# EAGLE board MJ838 - rev.1 - TCAN334 - poc (EAGLE 9.6.2)
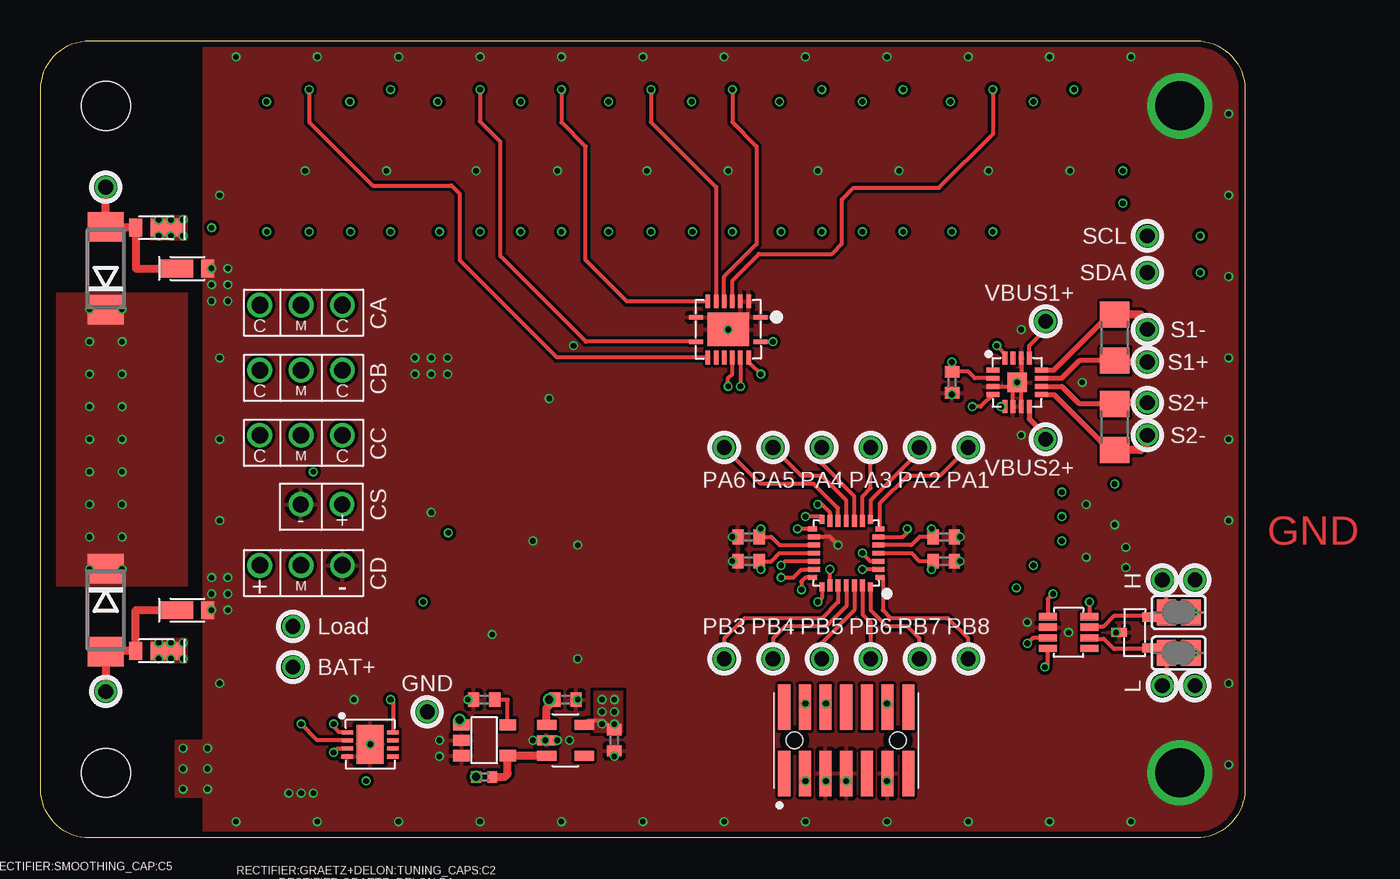
[diagram p18: board, top side]
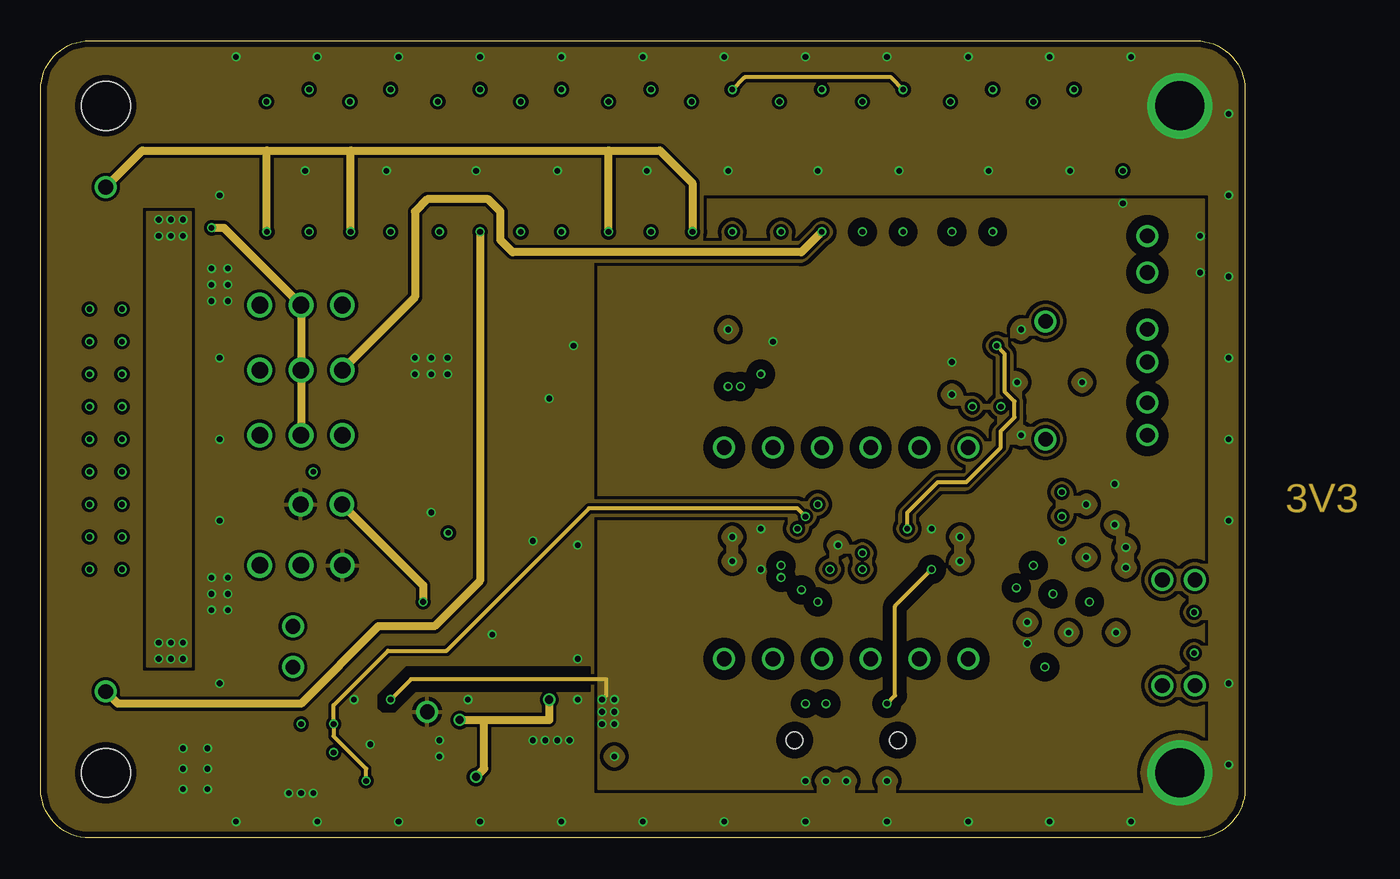
[diagram p19: board, inner layer Route2]
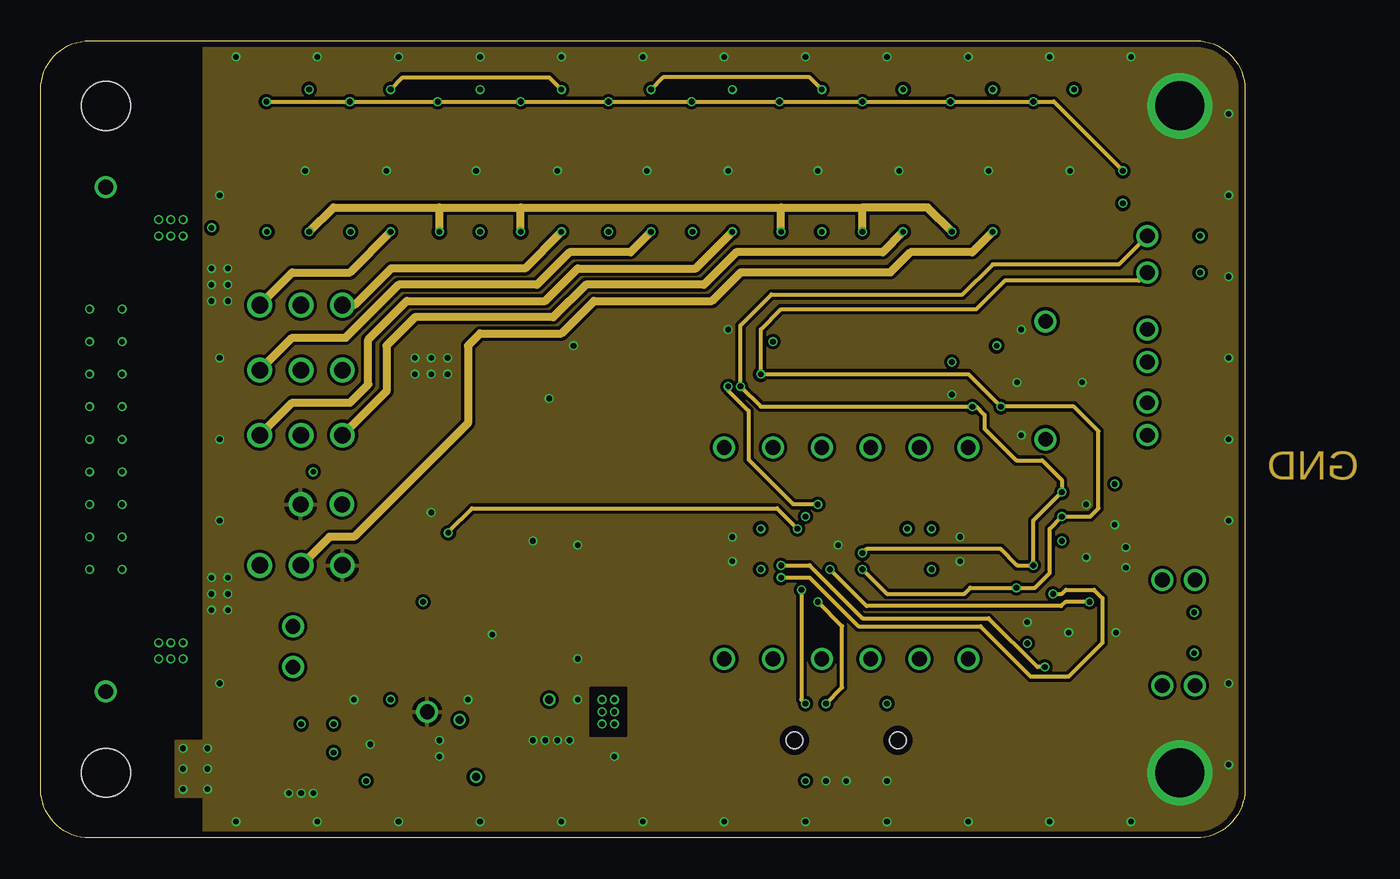
[diagram p20: board, inner layer Route15]
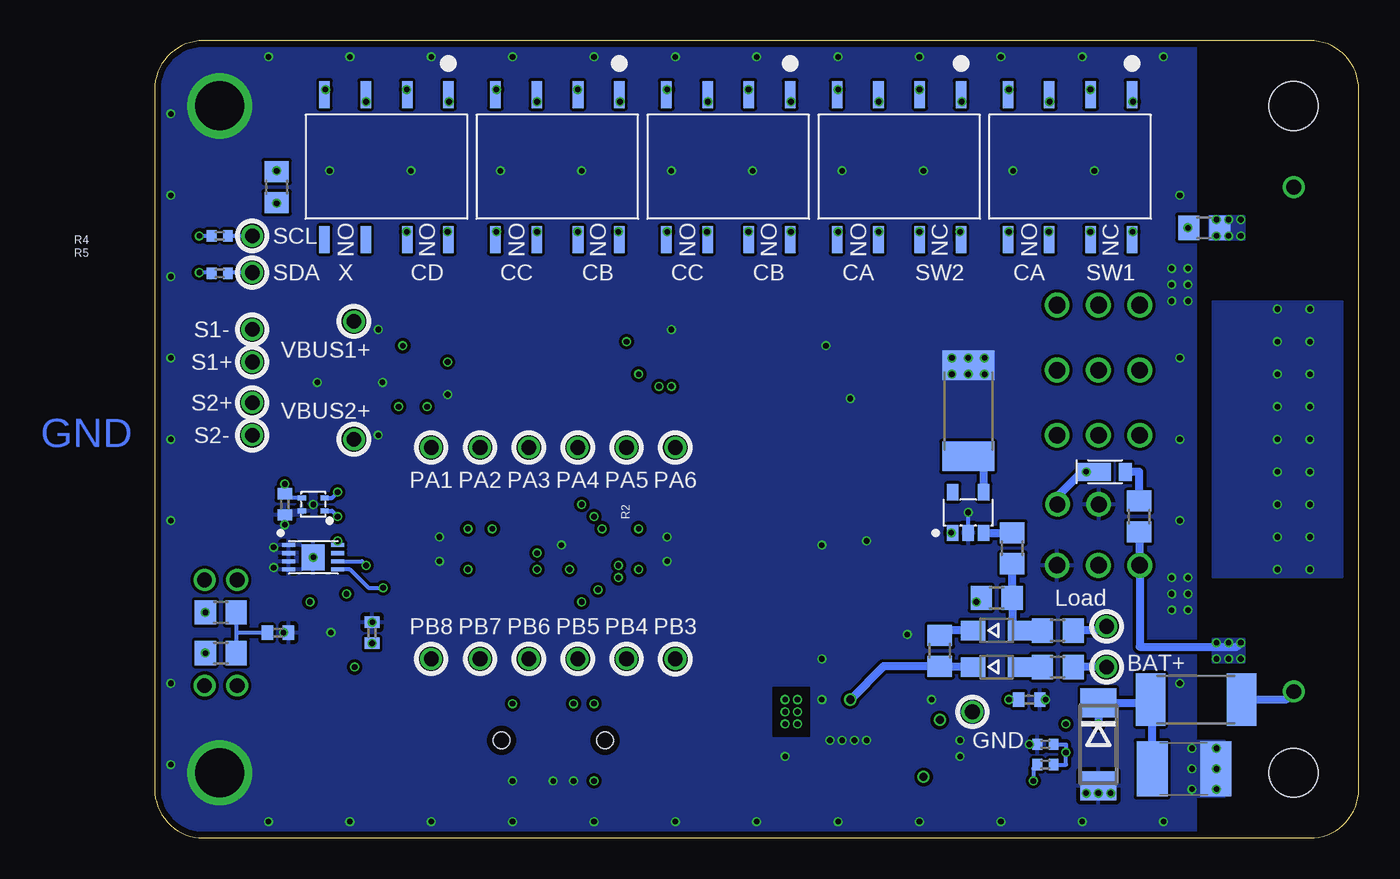
[diagram p21: board, bottom side, seen from below]

Size 74 x 49 mm. Coordinates in mm from the lower left corner, seen from the top.
Outline: 74,46 74,3 arc-90 71,0 3,0 arc-90 0,3 0,46 arc-90 3,49 71,49 arc-90 74,46
Copper layers (1*2*15*16): Top 0.035559375mm / dielectric 0.17018125mm / Route2 0.01778125mm / dielectric 47mil / Route15 0.01778125mm / dielectric 0.17018125mm / Bottom 0.035559375mm
Design rules "oshpark-4layer": minimum track width 5mil, minimum drill 10mil, track to track 5mil, track to pad 5mil, pad to pad 5mil, via to via 5mil, smd to smd 5mil, copper to edge 15mil, drill to drill 6mil, minimum pad ring 4mil, minimum via ring 4mil, stop-mask expansion 1.5mil, vias tented up to drill 0mil, thermal gap 10mil
Net classes: 0 GND: width 0.25 mm, drill 0.35 mm, clearance 0.19 mm; 1 BAT+: width 0.5 mm, drill 0.5 mm, clearance 0.5 mm to class 0, clearance 0.5 mm; 2 signal: width 0.25 mm, drill 0.35 mm, clearance 0.19 mm to class 0, clearance 0.19 mm to class 1, clearance 0.19 mm; 3 3V3: width 0.25 mm, drill 0.35 mm, clearance 0.19 mm to class 0, clearance 0.19 mm to class 1, clearance 0.19 mm to class 2, clearance 0.19 mm; 4 VDC: width 0.5 mm, drill 0.35 mm, clearance 0.5 mm to class 0, clearance 0.5 mm to class 1, clearance 0.5 mm to class 2, clearance 0.5 mm to class 3, clearance 0.5 mm; 5 VDynamo: width 0.5 mm, drill 0.35 mm, clearance 0.5 mm to class 0, clearance 0.5 mm to class 1, clearance 0.5 mm to class 2, clearance 0.5 mm to class 3, clearance 0.5 mm to class 4, clearance 0.5 mm; 6 VAC: width 0.5 mm, drill 0.35 mm, clearance 0.5 mm to class 0, clearance 0.5 mm to class 1, clearance 0.5 mm to class 2, clearance 0.5 mm to class 3, clearance 0.5 mm to class 4, clearance 0.5 mm to class 5, clearance 0.5 mm
Holes 3 mm at 4,45 4,4
tKeepout: area 66.5,41.5 to 73.5,48.5; area 0.5,0.5 to 7.5,7.5; area 0.5,41.5 to 7.5,48.5; area 66.5,0.5 to 73.5,7.5
bKeepout: area 0.5,0.5 to 7.5,7.5; area 0.5,41.5 to 7.5,48.5; area 66.5,0.5 to 73.5,7.5; area 66.5,41.5 to 73.5,48.5
tRestrict: 6 lines
bRestrict: 2 lines

## Footprints (pad centres in the part's own frame; a part is rotated, then mirrored left to right if it is on the bottom)
C0402 = smd 0.7 x 0.9: 1 -0.65,0; 2 0.65,0
SOD323-W = smd 1.5 x 1.2: A 1.45,0; C -1.45,0
UFQFPN-28 = smd 0.55 x 0.3: 1_PB8 -2.08,1.5; 7_PA1 -2.08,-1.5; 15_PB1 2.08,-1.5; 21_PA13 2.08,1.5 | smd 0.75 x 0.3: 2_PF0 -1.98,1; 3_PF1 -1.98,0.5; 4_NRST -1.98,0; 5_VDDA -1.98,-0.5; 6_PA0 -1.98,-1; 16_VSS 1.98,-1; 17_VDD 1.98,-0.5; 18_VDDIO2 1.98,0; 19_PA9-[PA11] 1.98,0.5; 20_PA10-[PA12] 1.98,1 | smd 0.3 x 0.55: 8_PA2 -1.5,-2.08; 14_PB0 1.5,-2.08; 22_PA14 1.5,2.08; 28_PB7 -1.5,2.08 | smd 0.3 x 0.75: 9_PA3 -1,-1.98; 10_PA4 -0.5,-1.98; 11_PA5 0,-1.98; 12_PA6 0.5,-1.98; 13_PA7 1,-1.98; 23_PA15 1,1.98; 24_PB3 0.5,1.98; 25_PB4 0,1.98; 26_PB5 -0.5,1.98; 27_PB6 -1,1.98
SOT23-8 = smd 0.45 x 1.1: P$1 -0.975,-1.275; P$2 -0.325,-1.275; P$3 0.325,-1.275; P$4 0.975,-1.275; P$5 0.975,1.275; P$6 0.325,1.275; P$7 -0.325,1.275; P$8 -0.975,1.275
SOT-23-3 = smd 0.56 x 0.95: 1 -0.95,-0.95; 2 0.95,-0.95; 3 0,0.95
VQFN16 = smd 0.8 x 0.3: 1_SLOW/!ALERT1! -1.5,0.75; 2_VDD -1.5,0.25; 3_GND -1.5,-0.25; 4_SCL -1.5,-0.75; 9_SENSE2- 1.5,-0.75; 10_SENSE2+ 1.5,-0.25; 11_SENSE1+ 1.5,0.25; 12_SENSE1- 1.5,0.75 | smd 0.3 x 0.8: 5_SDA -0.75,-1.5; 6_ADDRSEL -0.25,-1.5; 7_VBUS2- 0.25,-1.5; 8_VBUS2+ 0.75,-1.5; 13_VBUS1+ 0.75,1.5; 14_VBUS1- 0.25,1.5; 15_GPIO/!ALERT2! -0.25,1.5; 16_!PWRDN! -0.75,1.5 | smd 1.2 x 1.2: 17_GND 0,0
SON-8 = smd 0.25 x 0.8: P$1 -0.75,-1.5; P$2 -0.25,-1.5; P$3 0.25,-1.5; P$4 0.75,-1.5; P$5 0.75,1.5; P$6 0.25,1.5; P$7 -0.25,1.5; P$8 -0.75,1.5 | smd 1.6 x 1.4: P$9 0,0
SOT-23-5 = smd 0.7 x 1: P$1 0.95,1.25; P$2 0,1.25; P$3 -0.95,1.25; P$4 -0.95,-1.25; P$5 0.95,-1.25
SMD = smd 0.5 x 0.3: SCL -0.7,-0.4; SDA -0.7,0.4; VDD 0.7,-0.4; VSS 0.7,0.4
FTSH10701LDVKA = smd 0.74 x 2.79: 1 -3.81,-2.035; 2 -3.81,2.035; 3 -2.54,-2.035; 4 -2.54,2.035; 5 -1.27,-2.035; 6 -1.27,2.035; 7 0,-2.035; 8 0,2.035; 9 1.27,-2.035; 10 1.27,2.035; 11 2.54,-2.035; 12 2.54,2.035; 13 3.81,-2.035; 14 3.81,2.035 | hole 1.02: -3.175,0; 3.175,0
R0805 = smd 1.3 x 1.5: 1 -0.95,0; 2 0.95,0
R0402 = smd 0.6 x 0.7: 1 -0.5,0; 2 0.5,0
R1206 = smd 1.6 x 1.803: 1 -1.422,0; 2 1.422,0
R2512 = smd 1.8 x 3.2: 1 -2.8,0; 2 2.8,0
SOT23-5 = smd 0.7 x 1: 1_VDD -0.95,-1.4; 2_GND 0,-1.4; 3_GND 0.95,-1.4; 4_DOUT 0.95,1.45; 5_CD -0.95,1.45
SOT-23-5L = smd 0.6 x 1.2: ADJ/NC -0.95,-1.15; EN -0.95,1.15; GND 0,1.15; IN 0.95,1.15; OUT 0.95,-1.15
US2H = smd 2 x 1.1: A -1,0 | smd 0.8 x 1.1: C 0.9,0
TH-2S = drill 1.016: 1_POS -2.54,0; 2_MID 0,0; 3_NEG 2.54,0
SMD_DIP8 = smd 0.65 x 1.65: 1_ANODE1 -3.81,-4.44; 2_CATHODE1 -1.27,-4.44; 3_ANODE2 1.27,-4.44; 4_CATHODE2 3.81,-4.44; 5_DRAIN2-1 3.81,4.48; 6_DRAIN2-2 1.27,4.48; 7_DRAIN1-1 -1.27,4.48; 8_DRAIN1-2 -3.81,4.48
VQFN16' = smd 0.85 x 0.28: 1 -1.975,-0.75; 8 1.975,-0.75; 9 1.975,0.75; 16 -1.975,0.75 | smd 0.28 x 0.85: 2 -1.25,-1.725; 3 -0.75,-1.725; 4 -0.25,-1.725; 5 0.25,-1.725; 6 0.75,-1.725; 7 1.25,-1.725; 10 1.25,1.725; 11 0.75,1.725; 12 0.25,1.725; 13 -0.25,1.725; 14 -0.75,1.725; 15 -1.25,1.725 | smd 2.55 x 2.05: 17 0,0
TH-2S-BACK-TO-BACK = drill 1.016: 1_C -2.54,0; 2_MID 0,0; 3_C 2.54,0
DO214AA = smd 1.8 x 2.2: A 2.55,0; C -2.55,0
TH = drill 1: NEG -1.27,0; POS 1.27,0
C1812 = smd 1.9 x 3.4: 1 -1.95,0; 2 1.95,0
DFN-8 = smd 0.25 x 0.7: 1_A_OUT -0.75,-1.4; 2_A_IN- -0.25,-1.4; 3_A_IN+ 0.25,-1.4; 4_V- 0.75,-1.4; 5_B_IN+ 0.75,1.4; 6_B_IN- 0.25,1.4; 7_B_OUT -0.25,1.4; 8_V+ -0.75,1.4 | smd 2.38 x 1.65: 9_V- 0,0
SJ = smd 1.168 x 1.6: 1 -0.762,0; 2 0.762,0
TH-0.9 = drill 0.9: P$1 0,0

## Placement (x,y rotation side)
C301  0.1uF / 10V  [C0402]  43.5,18.5 0 top
C304  1uF / 10V  [C0402]  55.5,18.5 180 top
C305  0.1uF / 10V  [C0402]  43.5,17 0 top
C307  0.1uF / 10V  [C0402]  55.5,17 180 top
C401  47nF / 10V  [C0402]  66.42,12.61 0 bottom
C405  0.1uF / 10V  [C0402]  60.64,12.61 90 bottom
C605  0.1uF / 10V  [C0402]  56,28 270 top
C905  0.1uF / 10V  [C0402]  66,20.5 270 bottom
D501  BAT 60A E6327  [SOD323-W]  22.25,10.5 0 bottom
D502  BAT 60A E6327  [SOD323-W]  22.25,12.75 0 bottom
IC302  STM32F042G6U6  [UFQFPN-28]  49.5,17.5 180 top
IC401  TCAN334GDCNT  [SOT23-8]  63.17,12.62 270 top
IC402  SZNUP2105LT1G  [SOT-23-3]  67.23,12.62 90 top
IC601  PAC1952T-1E/4MX  [VQFN16]  60,28 0 top
IC701  MB85RC16PN-G-AMERE1  [SON-8]  64.25,17.25 270 bottom
IC801  MIC2514YM5  [SOT-23-5]  24,20 180 bottom
IC901  SHT40-AD1F-R2  [SMD]  64.25,20.5 180 bottom
J1  FTSH-107-01-L-DV-K-A  [FTSH10701LDVKA]  49.5,6 0 top
R1  0R  [R0805]  18.5,10.5 0 bottom
R2  0R  [R0805]  21.3,17.8 90 bottom
R3  0R  [R0805]  18.5,12.75 180 bottom
R4  4k7  [R0402]  70,37 180 bottom
R5  4k7  [R0402]  70,34.7 180 bottom
R401  60R, 0.5W  [R0805]  69.93,11.36 0 bottom
R402  60R, 0.5W  [R0805]  69.93,13.86 180 bottom
R502  0R  [R0805]  13.5,19.75 90 bottom
R504  0R  [R0805]  25.75,11.5 270 bottom
R505  0R  [R0805]  22.25,14.75 0 bottom
R601  0.1R / 0.5W / 0.25%  [R1206]  66,30.75 90 top
R602  0.1R / 0.5W / 0.25%  [R1206]  66,25.25 270 top
R802  12R / 5W  [R2512]  24,26.25 270 bottom
RECTIFIER:3V3:C1  1uF / 10V  [C0402]  27.25,8.5 180 top
RECTIFIER:3V3:C2  1uF / 10V  [C0402]  32.25,8.5 0 top
RECTIFIER:3V3:C7  1uF / 10V  [C0402]  35.25,6 90 top
RECTIFIER:3V3:IC1  R3119N058A  [SOT23-5]  27.25,6 270 top
RECTIFIER:3V3:IC2  LDK320AM33R  [SOT-23-5L]  32.25,6 90 top
RECTIFIER:3V3:R1  100k / 0.1W  [R0402]  27.25,3.75 0 top
RECTIFIER:GRAETZ+DELON:D1  CUHS20S30,H3F  [US2H]  6.75,37.5 180 top
RECTIFIER:GRAETZ+DELON:D2  CUHS20S30,H3F  [US2H]  9.38,35 0 top
RECTIFIER:GRAETZ+DELON:D3  CUHS20S30,H3F  [US2H]  6.75,11.5 180 top
RECTIFIER:GRAETZ+DELON:D4  CUHS20S30,H3F  [US2H]  9.38,14 0 top
RECTIFIER:GRAETZ+DELON:DELON:C1  330μF / 35V / ultralow ESR  [TH-2S]  16,16.75 0 top
RECTIFIER:GRAETZ+DELON:DELON:SSR_NO/NO3:IC1  LAA710S  [SMD_DIP8]  59.75,41.25 180 bottom
RECTIFIER:GRAETZ+DELON:IC1  TLC59208FIRGYR  [VQFN16']  42.25,31.25 180 top
RECTIFIER:GRAETZ+DELON:R1  430R/0.5W  [R0805]  66.5,40 270 bottom
RECTIFIER:GRAETZ+DELON:TUNING_CAPS:C2  1500μF / 35V / ultralow ESR  [TH-2S-BACK-TO-BACK]  16,32.75 0 top
RECTIFIER:GRAETZ+DELON:TUNING_CAPS:C3  1500μF / 35V / ultralow ESR  [TH-2S-BACK-TO-BACK]  16,28.75 0 top
RECTIFIER:GRAETZ+DELON:TUNING_CAPS:C4  1500μF / 35V / ultralow ESR  [TH-2S-BACK-TO-BACK]  16,24.75 0 top
RECTIFIER:GRAETZ+DELON:TUNING_CAPS:R2  47k  [R0805]  9.5,37.5 0 bottom
RECTIFIER:GRAETZ+DELON:TUNING_CAPS:SSR_NC/NO1:IC2  LBA710S  [SMD_DIP8]  17.75,41.25 180 bottom
RECTIFIER:GRAETZ+DELON:TUNING_CAPS:SSR_NC/NO2:IC2  LBA710S  [SMD_DIP8]  28.25,41.25 180 bottom
RECTIFIER:GRAETZ+DELON:TUNING_CAPS:SSR_NO/NO1:IC1  LAA710S  [SMD_DIP8]  38.75,41.25 180 bottom
RECTIFIER:GRAETZ+DELON:TUNING_CAPS:SSR_NO/NO2:IC1  LAA710S  [SMD_DIP8]  49.25,41.25 180 bottom
RECTIFIER:OVP:D1  19V/5W  [DO214AA]  4,35 90 top
RECTIFIER:OVP:D2  19V/5W  [DO214AA]  4,14 270 top
RECTIFIER:SMOOTHING_CAP:C5  2P 4700μF / 35V / ultralow ESR  [TH]  17.25,20.5 0 top
RECTIFIER:SMOOTHING_CAP:D8  CUHS20S30,H3F  [US2H]  15.25,22.5 0 bottom
RECTIFIER:ZERO-CROSS_DETECTOR:C3  0.1uF / 10V  [C0402]  20.25,8.5 180 bottom
RECTIFIER:ZERO-CROSS_DETECTOR:C8  10nF / 100v  [C1812]  10.75,4.25 180 bottom
RECTIFIER:ZERO-CROSS_DETECTOR:D10  6V/3W  [DO214AA]  16,5.75 270 bottom
RECTIFIER:ZERO-CROSS_DETECTOR:IC1  LT1638IDD#PBF  [DFN-8]  20.25,5.75 270 top
RECTIFIER:ZERO-CROSS_DETECTOR:R1  10k/3W  [R2512]  10,8.5 180 bottom
RECTIFIER:ZERO-CROSS_DETECTOR:R2  10k  [R0402]  19.25,5.75 0 bottom
RECTIFIER:ZERO-CROSS_DETECTOR:R7  10k  [R0402]  19.25,4.5 0 bottom
SJ401  CAN H term.  [SJ]  69.93,13.86 0 top
SJ402  CAN L term.  [SJ]  69.93,11.36 0 top
TP1  BAT+  [TH-0.9]  15.5,10.5 90 top
TP2  CAN high  [TH-0.9]  4,40 90 top
TP3  CAN high  [TH-0.9]  4,9 90 top
TP4  CAN high  [TH-0.9]  57,24 0 top
TP5  CAN high  [TH-0.9]  54,24 270 top
TP6  CAN high  [TH-0.9]  51,24 270 top
TP7  CAN high  [TH-0.9]  48,24 270 top
TP8  CAN high  [TH-0.9]  45,24 270 top
TP9  CAN high  [TH-0.9]  42,24 270 top
TP10  CAN high  [TH-0.9]  42,11 90 top
TP11  CAN high  [TH-0.9]  45,11 90 top
TP12  CAN high  [TH-0.9]  48,11 90 top
TP13  CAN high  [TH-0.9]  51,11 90 top
TP14  CAN high  [TH-0.9]  54,11 90 top
TP15  CAN high  [TH-0.9]  57,11 90 top
TP16  CAN high  [TH-0.9]  68.93,15.86 270 top
TP17  CAN high  [TH-0.9]  70.93,15.86 270 top
TP18  CAN low  [TH-0.9]  68.93,9.36 270 top
TP19  CAN low  [TH-0.9]  70.93,9.36 270 top
TP20  GND  [TH-0.9]  23.75,7.75 180 top
TP21  CAN high  [TH-0.9]  15.5,13 180 top
TP22  CAN high  [TH-0.9]  68,37 0 top
TP23  CAN high  [TH-0.9]  68,34.75 0 top
TP24  CAN high  [TH-0.9]  61.75,31.75 0 top
TP25  CAN high  [TH-0.9]  61.75,24.5 0 top
TP26  CAN high  [TH-0.9]  68,29.25 0 top
TP27  CAN high  [TH-0.9]  68,31.25 0 top
TP28  CAN high  [TH-0.9]  68,26.75 0 top
TP29  CAN high  [TH-0.9]  68,24.75 0 top

## Tracks (layer width: path | path; a pad name or v marks a point on that pad's centre or on a via)
3V3  (via drill 0.35)
  Top 0.25: RECTIFIER:3V3:IC2.OUT 33.65,7.2 34.58,7.2 35.12,6.65 RECTIFIER:3V3:C7.2 | IC601.2_VDD 57.4,28.25 57,28.65 C605.1 v56,29.25 | J1.3 47,3.92 v47,3.5 | v44.25,16.5 44.15,16.6 C305.2 44.9,17 45.4,17.5 IC302.18_VDDIO2 | v44.25,19 44.15,18.9 C301.2 44.9,18.5 45.4,18 IC302.17_VDD | IC302.5_VDDA 53.5,18 54,18.5 C304.2 54.75,18.6 v54.75,19 | C405.1 60.96,12.29 61.88,12.29 IC401.P$3 | v21.5,8.5 21.65,8.35 RECTIFIER:ZERO-CROSS_DETECTOR:IC1.8_V+ | RECTIFIER:GRAETZ+DELON:IC1.16 v45,30.5
  Route2 0.25: v21.5,8.5 22.75,9.75 34.75,9.75 34.75,8.75 v34.5,8.5
  Bottom 0.25: v62.75,18.25 IC701.P$8 | RECTIFIER:GRAETZ+DELON:R1.2 v66.5,39 | IC901.VDD 65.75,20.9 C905.1 v66,21.75 | R4.2 v71.25,37 | R5.2 70.55,34.75 v71.25,34.75 | RECTIFIER:ZERO-CROSS_DETECTOR:C3.2 v21.5,8.5
  other vias: 60.64,11.96 35.25,8.5 35.25,7.75 35.25,7 34.5,7.75 34.5,7
  pour Route2 (isolate 0.61, rank 2): 34.25,39.25 71.5,39.25 71.5,3 34.25,3
  pour Top (rank 2, no thermals): 34,9 35.75,9 35.75,6.5 34,6.5
!ARTIFICIAL_LOAD!  (via drill 0.35)
  Top 0.25: IC302.15_PB1 v46.5,19
  Route15 0.25: v46.5,19 45.25,20.25 26.5,20.25 25.05,18.8 v25.05,18.75
  Bottom 0.25: IC801.P$1 v25.05,18.75
!LED_RST!  (via drill 0.35)
  Top 0.25: v47.75,20.5 48,20.5 48.5,20 IC302.13_PA7 | RECTIFIER:GRAETZ+DELON:IC1.13 42.5,28.5 42.25,28.25 v42.25,27.75
  Route15 0.25: v42.25,27.75 42.25,27.5 43.5,26.25 43.5,23.25 46.25,20.5 v47.75,20.5
!STBY!  (via drill 0.35)
  Top 0.25: IC302.23_PA15 v48.5,16.5 | v64.46,14.5 64.46,13.61 IC401.P$8
  Route15 0.25: v64.46,14.5 62.96,14.5 62.71,14.25 50.75,14.25 v48.5,16.5
AAA
  cutout Route2: 20.75,8.75 22.5,10.5 33.75,10.5 33.75,9 23,9 21.75,7.75 21,7.75 20.75,8
ART_LOAD_IN
  Bottom 0.5: IC801.P$3 R2.2
ARTIFICIAL_LOAD:LOAD_HIGHSIDE
  Bottom 0.5: IC801.P$4 23.05,23 23.5,23.45 R802.2
BAT
  Bottom 0.5: R1.1 D501.A
BAT+
  Bottom 0.5: TP1.P$1 R1.2
CAN_H
  Top 0.25: TP17.P$1 TP16.P$1 69.17,15.62 SJ401.1 68.88,13.57 IC402.2 68.11,13.64 65.96,13.64 65.33,13 64.5,13 IC401.P$7
CAN_INFRA:H  (via drill 0.35)
  Top 0.25: SJ401.2 R402.2
  other vias: 70.88,13.86
CAN_INFRA:L  (via drill 0.35)
  Top 0.25: SJ402.2 R401.1
  other vias: 70.88,11.36
CAN_INFRA:SPLIT
  Bottom 0.25: R402.1 68.98,12.61 | 68.98,12.61 R401.2 | C401.1 68.98,12.61
CAN_L
  Top 0.25: TP19.P$1 TP18.P$1 69.17,9.6 SJ402.1 68.86,11.67 IC402.1 68.11,11.61 65.96,11.61 65.33,12.24 64.5,12.24 IC401.P$6
CAN_RX  (via drill 0.35)
  Top 0.25: IC302.19_PA9-[PA11] 45.75,17 v45.5,16.75 | v61.71,10.5 61.89,10.69 IC401.P$4
  Route15 0.25: v61.71,10.5 61.25,10.5 58.25,13.5 50.5,13.5 47.25,16.75 v45.5,16.75
CAN_TX  (via drill 0.35)
  Top 0.25: IC302.20_PA10-[PA12] 46.75,16.5 46.25,16 v45.5,16 | v62.21,15 61.89,14.69 IC401.P$1
  Route15 0.25: v45.5,16 47.25,16 50.25,13 57.75,13 60.84,9.91 63.16,9.91 65.25,12 65.25,14.73 64.73,15.25 63,15.25 62.75,15 v62.21,15
DYNAMO1  (via drill 0.35)
  Top 0.5: TP2.P$1 RECTIFIER:OVP:D1.A 4.05,37.5 RECTIFIER:GRAETZ+DELON:D1.C 5.85,35 RECTIFIER:GRAETZ+DELON:D2.A
  Route2 0.5: v40.05,37.25 40.05,40.25 38.05,42.25 34.9,42.25 | TP2.P$1 6.25,42.25 13.9,42.25 | v13.9,37.25 13.9,42.25 | 13.9,42.25 19.05,42.25 | 19.05,42.25 34.9,42.25 | v19.05,37.25 19.05,42.25 | v34.9,37.25 34.9,42.25
  Bottom 0.5: RECTIFIER:GRAETZ+DELON:TUNING_CAPS:SSR_NC/NO1:IC2.6_DRAIN2-2 19.02,37.25 v19.05,37.25 | RECTIFIER:GRAETZ+DELON:TUNING_CAPS:SSR_NC/NO1:IC2.8_DRAIN1-2 13.94,37.25 v13.9,37.25 | RECTIFIER:GRAETZ+DELON:TUNING_CAPS:SSR_NO/NO1:IC1.8_DRAIN1-2 34.9,36.77 v34.9,37.25 | RECTIFIER:GRAETZ+DELON:TUNING_CAPS:SSR_NO/NO1:IC1.6_DRAIN2-2 40.02,37.25 v40.05,37.25
DYNAMO2  (via drill 0.35)
  Top 0.5: TP3.P$1 RECTIFIER:OVP:D2.A 4.05,11.5 RECTIFIER:GRAETZ+DELON:D3.C 5.85,14 RECTIFIER:GRAETZ+DELON:D4.A
  Route2 0.5: v27,37.25 27,15.8 24.2,13 20.75,13 16,8.25 4.75,8.25 TP3.P$1
  Bottom 0.5: TP3.P$1 4.5,8.5 RECTIFIER:ZERO-CROSS_DETECTOR:R1.1 | RECTIFIER:GRAETZ+DELON:TUNING_CAPS:SSR_NC/NO2:IC2.7_DRAIN1-1 26.98,37.23 v27,37.25
E
  cutout Bottom: 33.75,9.25 36,9.25 36,6.25 33.75,6.25
  cutout Route15: 33.75,9.25 36,9.25 36,6.25 33.75,6.25
GND  (via drill 0.35, 3)
  Top 0.25: IC601.6_ADDRSEL 59.75,27.75 | IC601.3_GND 59.75,27.75 | 59.75,27.75 IC601.17_GND | v49,18 48.5,18.5 IC302.16_VSS | IC601.14_VBUS1- 60.25,28.25 IC601.17_GND | IC601.7_VBUS2- 60.25,27.75 IC601.17_GND
  Bottom 0.25: IC801.P$2 v24,20
  other vias: 19.25,8.5 20.25,5.75 63.17,12.62 16.25,41 21.25,41 26.75,41 31.75,41 37.25,41 42.25,41 47.75,41 52.75,41 58.25,41 63.25,41 70,45 70,4 42,48 42,1 73,24.5 47,1 52,1 57,1 62,1 67,1 37,1 32,1 27,1 22,1 17,1 12,1 47,48 52,48 57,48 62,48 67,48 37,48 32,48 27,48 22,48 17,48 12,48 73,29.5 73,34.5 73,39.5 73,19.5 60.63,13.26 73,9.5 10.5,34 11.5,34 10.5,33 11.5,33 10.5,35 11.5,35 10.5,15 10.5,14 11.5,14 11.5,15 11.5,16 10.5,16 11,24.5 11,29.5 11,39.5 11,19.5 11,9.5 8.75,3 8.75,4.25 8.75,5.5 15.25,2.75 16.75,2.75 31.75,6 25,29.5 24,29.5 23,29.5 25,28.5 24,28.5 23,28.5 24.5,5 56.5,18.5 56.5,17 42.5,18.5 42.5,17 10.25,4.25 10.25,3 10.25,5.5 73,4.5 73,44.5 48.25,3.5 49.5,3.5 52,3.5 66,19.25 64.25,20.5 64.25,17.25 60,28 66.68,17.86 66.68,16.61 56,27.25 35.25,5 33,8.5 26.25,8.5 24.5,6 16,2.75 31,6 30.25,6 42.25,31.25 32.75,30.25 31.25,27 30.25,18.25 27.75,12.5 33,11 33,18 32.5,6 64,28 60.25,31.25 60.25,24.75 66.08,12.62
  pour Top (rank 6): 10,50 75,50 75,-1 10,-1
  pour Bottom (rank 6): 10,50 75,50 75,-1 10,-1
  pour Route15 (rank 6): 10,50 75,50 75,-1 10,-1
  pour Bottom (no thermals): 8.25,2.5 8.25,6 10.75,6 10.75,2.5
  pour Top (no thermals): 10.75,2.5 10.75,6 8.25,6 8.25,2.5
  pour Top (no thermals): 11.25,13 11.25,15 10,15 10,13
  pour Top (no thermals): 11.25,34 11.25,36 10,36 10,34
  pour Bottom (no thermals): 22,30.25 26,30.25 26,27.75 22,27.75
  pour Route2 (rank 6): -0.75,50 75,50 75,-1 -0.75,-1
  pour Route15: 8.25,6 10.75,6 10.75,2.5 8.25,2.5
I2C_SCL  (via drill 0.35)
  Top 0.25: IC302.3_PF1 50.98,17 50.5,17.48 v50.5,17.5 | IC601.4_SCL 57.75,26.5 v57.25,26.5 | RECTIFIER:GRAETZ+DELON:IC1.14 v43,27.75
  Route15 0.25: TP22.P$1 66.25,35.25 58.5,35.25 56.65,33.4 44.9,33.4 43,31.5 v43,27.75 44.25,26.5 v57.25,26.5 57.5,26.5 58,26 58,25.16 59.96,23.2 61.55,23.2 62.75,22 v62.75,21.25 61,19.5 v61,16.75 60,16.75 59,17.75 50.75,17.75 v50.5,17.5
  Bottom 0.25: IC701.P$6 61.25,17 v61,16.75 | IC901.SCL 63.1,20.9 v62.75,21.25 | TP22.P$1 R4.1
I2C_SDA  (via drill 0.35)
  Top 0.25: IC601.5_SDA v59,26.5 | IC302.2_PF0 v50.5,16.5 | RECTIFIER:GRAETZ+DELON:IC1.15 43.5,29.25 v44.25,28.5
  Route15 0.25: v50.5,16.5 52,15 56.75,15 57.12,15.37 v59.96,15.37 61.09,15.37 62,16.28 62,19 v62.75,19.75 64.5,19.75 65,20.25 65,25 63.5,26.5 v59,26.5 57,28.5 v44.25,28.5 44.25,31.25 45.5,32.5 57.5,32.5 59.25,34.25 67.5,34.25 TP23.P$1
  Bottom 0.25: IC701.P$5 61.99,16.5 60.86,15.37 v59.96,15.37 | IC901.SDA 63.1,20.1 v62.75,19.75 | TP23.P$1 69.45,34.75 R5.1
LOAD2
  Bottom 0.5: TP21.P$1 15.75,12.75 R3.1
PA1
  Top 0.25: TP4.P$1 55.25,22.25 53.25,22.25 51.58,20.58 IC302.7_PA1
PA2
  Top 0.25: IC302.8_PA2 51,20.75 54,23.75 TP5.P$1
PA3
  Top 0.25: IC302.9_PA3 50.5,21 51,21.5 TP6.P$1
PA4
  Top 0.25: IC302.10_PA4 50,21 48,23 TP7.P$1
PA5
  Top 0.25: IC302.11_PA5 49.5,20.75 48,22.25 46.75,22.25 TP8.P$1
PA6
  Top 0.25: TP9.P$1 44.24,21.76 47.49,21.76 49,20.25 IC302.12_PA6
PB3
  Top 0.25: IC302.24_PB3 49,14.5 48,13.5 43.25,13.5 42,12.25 TP10.P$1
PB4
  Top 0.25: TP11.P$1 45,12.25 45.75,13 48.25,13 49.5,14.25 IC302.25_PB4
PB5
  Top 0.25: IC302.26_PB5 50,14 48,12 TP12.P$1
PB6
  Top 0.25: IC302.27_PB6 50.5,13.75 51,13.25 TP13.P$1
PB7
  Top 0.25: IC302.28_PB7 51,14 52,13 53.25,13 54,12.25 TP14.P$1
PB8
  Top 0.25: TP15.P$1 57,12.25 55.75,13.5 52.25,13.5 51.75,14 51.75,16 IC302.1_PB8
PM_!PWRDN!  (via drill 0.35)
  Top 0.25: v53.25,19 53.25,18.77 52.98,18.5 IC302.6_PA0 | v58.75,30.25 59.25,29.75 IC601.16_!PWRDN!
  Route2 0.25: v58.75,30.25 59.25,29.75 59.25,27.41 59.84,26.82 59.84,25.84 59,25 59,24 56.88,21.88 55.12,21.88 53.25,20 v53.25,19
RECTIFIER:3V3:!EN!
  Top 0.5: RECTIFIER:3V3:IC2.EN RECTIFIER:3V3:IC1.4_DOUT 28.7,3.95 28.5,3.75 RECTIFIER:3V3:R1.2
RECTIFIER:3V3:CD
  Top 0.25: RECTIFIER:3V3:IC1.5_CD 28.7,8.5 RECTIFIER:3V3:C1.1
RECTIFIER:GRAETZ+DELON:!SW1!  (via drill 0.35)
  Top 0.25: v16.5,46 16.5,44 20.41,40.09 25.25,40.09 25.75,39.59 25.75,35.5 31.73,29.52 RECTIFIER:GRAETZ+DELON:IC1.10
  Bottom 0.25: RECTIFIER:GRAETZ+DELON:TUNING_CAPS:SSR_NC/NO1:IC2.2_CATHODE1 16.5,45.71 v16.5,46
RECTIFIER:GRAETZ+DELON:!SW2!  (via drill 0.35)
  Top 0.25: v27,46 27,44.02 28.25,42.77 28.25,35.75 33.5,30.5 RECTIFIER:GRAETZ+DELON:IC1.9
  Bottom 0.25: RECTIFIER:GRAETZ+DELON:TUNING_CAPS:SSR_NC/NO2:IC2.2_CATHODE1 27,45.71 v27,46
RECTIFIER:GRAETZ+DELON:!SW_CA!  (via drill 0.35)
  Top 0.25: v32,46 32,43.98 33.49,42.49 33.49,35.51 36.02,32.98 RECTIFIER:GRAETZ+DELON:IC1.7
  Route15 0.25: v21.5,46 22.25,46.75 31.25,46.75 v32,46
  Bottom 0.25: RECTIFIER:GRAETZ+DELON:TUNING_CAPS:SSR_NC/NO2:IC2.4_CATHODE2 32,45.75 v32,46 | RECTIFIER:GRAETZ+DELON:TUNING_CAPS:SSR_NC/NO1:IC2.4_CATHODE2 21.5,45.75 v21.5,46
RECTIFIER:GRAETZ+DELON:!SW_CB!  (via drill 0.35)
  Top 0.25: v37.5,46 37.5,44 41.5,40 RECTIFIER:GRAETZ+DELON:IC1.6
  Route15 0.25: v37.5,46 38.25,46.75 47.25,46.75 v48,46
  Bottom 0.25: RECTIFIER:GRAETZ+DELON:TUNING_CAPS:SSR_NO/NO2:IC1.2_CATHODE1 48,45.71 v48,46 | RECTIFIER:GRAETZ+DELON:TUNING_CAPS:SSR_NO/NO1:IC1.2_CATHODE1 37.5,45.71 v37.5,46
RECTIFIER:GRAETZ+DELON:!SW_CC!  (via drill 0.35)
  Top 0.25: v42.5,46 42.5,44 44,42.5 44,36.48 42,34.48 RECTIFIER:GRAETZ+DELON:IC1.5
  Route2 0.25: v42.5,46 43.25,46.75 52.25,46.75 v53,46
  Bottom 0.25: RECTIFIER:GRAETZ+DELON:TUNING_CAPS:SSR_NO/NO2:IC1.4_CATHODE2 53.06,45.94 v53,46 | RECTIFIER:GRAETZ+DELON:TUNING_CAPS:SSR_NO/NO1:IC1.4_CATHODE2 42.5,45.75 v42.5,46
RECTIFIER:GRAETZ+DELON:!SW_CD!  (via drill 0.35)
  Top 0.25: v58.5,46 58.5,43.25 55.21,39.96 49.96,39.96 49.24,39.24 49.24,36.51 48.61,35.89 44.14,35.89 42.5,34.25 RECTIFIER:GRAETZ+DELON:IC1.4
  Bottom 0.25: RECTIFIER:GRAETZ+DELON:DELON:SSR_NO/NO3:IC1.2_CATHODE1 58.5,45.71 v58.5,46
RECTIFIER:GRAETZ+DELON:DELON  (via drill 0.35)
  Route15 0.5: 24.5,38.75 29.5,38.75 | 29.5,38.75 45.5,38.75 | 45.5,38.75 50.5,38.75 | v45.5,37.25 45.5,38.75 | v50.5,37.25 50.5,38.75 | v24.5,37.25 24.5,38.75 | v29.5,37.25 29.5,38.75 | v16.5,37.25 18,38.75 24.5,38.75 | v56,37.25 54.5,38.75 50.5,38.75
  Bottom 0.5: RECTIFIER:GRAETZ+DELON:TUNING_CAPS:SSR_NC/NO2:IC2.8_DRAIN1-2 24.5,36.77 v24.5,37.25 | v29.5,37.25 29.5,36.79 RECTIFIER:GRAETZ+DELON:TUNING_CAPS:SSR_NC/NO2:IC2.6_DRAIN2-2 | v16.5,37.25 16.5,36.79 RECTIFIER:GRAETZ+DELON:TUNING_CAPS:SSR_NC/NO1:IC2.7_DRAIN1-1 | RECTIFIER:GRAETZ+DELON:TUNING_CAPS:SSR_NO/NO2:IC1.8_DRAIN1-2 45.5,36.77 v45.5,37.25 | RECTIFIER:GRAETZ+DELON:TUNING_CAPS:SSR_NO/NO2:IC1.6_DRAIN2-2 50.52,37.23 v50.5,37.25 | v56,37.25 56,36.83 RECTIFIER:GRAETZ+DELON:DELON:SSR_NO/NO3:IC1.8_DRAIN1-2
RECTIFIER:GRAETZ+DELON:DELON:SSR_NO/NO3:SW2_CAT  (via drill 0.35)
  Bottom 0.25: RECTIFIER:GRAETZ+DELON:DELON:SSR_NO/NO3:IC1.4_CATHODE2 63.5,45.75 v63.5,46
RECTIFIER:GRAETZ+DELON:DELON:SW1_OUT  (via drill 0.35)
  Route15 0.5: RECTIFIER:GRAETZ+DELON:DELON:C1.2_MID 17.75,18.5 19.25,18.5 26.25,25.5 26.25,30.25 27,31 32,31 34,33 41.25,33 43.02,34.77 52.23,34.77 53.45,36 57.25,36 v58.5,37.25
  Bottom 0.5: RECTIFIER:GRAETZ+DELON:DELON:SSR_NO/NO3:IC1.7_DRAIN1-1 58.48,37.23 v58.5,37.25
RECTIFIER:GRAETZ+DELON:SSR_ANODE  (via drill 0.35)
  Route15 0.25: v13.88,45.25 v19,45.25 v24.4,45.25 v29.5,45.25 v34.9,45.25 v40,45.25 v45.4,45.25 v50.5,45.25 v55.9,45.25 v61,45.25 62.25,45.25 v66.5,41
  Bottom 0.25: RECTIFIER:GRAETZ+DELON:DELON:SSR_NO/NO3:IC1.3_ANODE2 61.02,45.25 v61,45.25 | RECTIFIER:GRAETZ+DELON:DELON:SSR_NO/NO3:IC1.1_ANODE1 55.94,45.25 v55.9,45.25 | v50.5,45.25 50.52,45.25 RECTIFIER:GRAETZ+DELON:TUNING_CAPS:SSR_NO/NO2:IC1.3_ANODE2 | v45.4,45.25 45.44,45.25 RECTIFIER:GRAETZ+DELON:TUNING_CAPS:SSR_NO/NO2:IC1.1_ANODE1 | v40,45.25 40.02,45.25 RECTIFIER:GRAETZ+DELON:TUNING_CAPS:SSR_NO/NO1:IC1.3_ANODE2 | v34.9,45.25 34.94,45.25 RECTIFIER:GRAETZ+DELON:TUNING_CAPS:SSR_NO/NO1:IC1.1_ANODE1 | v29.5,45.25 29.52,45.25 RECTIFIER:GRAETZ+DELON:TUNING_CAPS:SSR_NC/NO2:IC2.3_ANODE2 | v24.4,45.25 24.44,45.25 RECTIFIER:GRAETZ+DELON:TUNING_CAPS:SSR_NC/NO2:IC2.1_ANODE1 | v13.88,45.25 13.94,45.25 RECTIFIER:GRAETZ+DELON:TUNING_CAPS:SSR_NC/NO1:IC2.1_ANODE1 | RECTIFIER:GRAETZ+DELON:R1.1 v66.5,41 | RECTIFIER:GRAETZ+DELON:TUNING_CAPS:SSR_NC/NO1:IC2.3_ANODE2 19.02,45.27 v19,45.25
RECTIFIER:GRAETZ+DELON:TUNING_CAPS:CAA  (via drill 0.35)
  Route15 0.5: RECTIFIER:GRAETZ+DELON:TUNING_CAPS:C2.1_C 15.46,34.75 19,34.75 v21.5,37.25
  Bottom 0.5: RECTIFIER:GRAETZ+DELON:TUNING_CAPS:SSR_NC/NO1:IC2.5_DRAIN2-1 21.5,36.83 v21.5,37.25
RECTIFIER:GRAETZ+DELON:TUNING_CAPS:CAB  (via drill 0.35)
  Route15 0.5: RECTIFIER:GRAETZ+DELON:TUNING_CAPS:C2.3_C 19.29,32.75 21.54,35 29.75,35 v32,37.25
  Bottom 0.5: RECTIFIER:GRAETZ+DELON:TUNING_CAPS:SSR_NC/NO2:IC2.5_DRAIN2-1 32,36.83 v32,37.25
RECTIFIER:GRAETZ+DELON:TUNING_CAPS:CBA  (via drill 0.35)
  Route15 0.5: RECTIFIER:GRAETZ+DELON:TUNING_CAPS:C3.1_C 15.46,30.75 18.75,30.75 22,34 30.5,34 32.5,36 36.25,36 v37.5,37.25
  Bottom 0.5: RECTIFIER:GRAETZ+DELON:TUNING_CAPS:SSR_NO/NO1:IC1.7_DRAIN1-1 37.48,37.23 v37.5,37.25
RECTIFIER:GRAETZ+DELON:TUNING_CAPS:CBB  (via drill 0.35)
  Route2 0.5: v48,37.25 46.75,36 29,36 28.25,36.75 28.25,38.5 27.5,39.25 23.75,39.25 23,38.5 23,33.25 18.54,28.79 RECTIFIER:GRAETZ+DELON:TUNING_CAPS:C3.3_C
  Bottom 0.5: RECTIFIER:GRAETZ+DELON:TUNING_CAPS:SSR_NO/NO2:IC1.7_DRAIN1-1 48,36.79 v48,37.25
RECTIFIER:GRAETZ+DELON:TUNING_CAPS:CCA  (via drill 0.35)
  Route15 0.5: RECTIFIER:GRAETZ+DELON:TUNING_CAPS:C4.1_C 15.46,26.75 19,26.75 20.12,27.88 20.12,30.62 22.5,33 31,33 33,35 40.25,35 v42.5,37.25
  Bottom 0.5: RECTIFIER:GRAETZ+DELON:TUNING_CAPS:SSR_NO/NO1:IC1.5_DRAIN2-1 42.56,37.19 v42.5,37.25
RECTIFIER:GRAETZ+DELON:TUNING_CAPS:CCB  (via drill 0.35)
  Route15 0.5: v53,37.25 51.75,36 42.75,36 40.75,34 33.5,34 31.5,32 23,32 21.25,30.25 21.25,27.46 RECTIFIER:GRAETZ+DELON:TUNING_CAPS:C4.3_C
  Bottom 0.5: RECTIFIER:GRAETZ+DELON:TUNING_CAPS:SSR_NO/NO2:IC1.5_DRAIN2-1 53,36.83 v53,37.25
RECTIFIER:GRAETZ+DELON:TUNING_CAPS:TUNING_CAP_BIAS  (via drill 0.35)
  Route2 0.5: v10.5,37.5 11.25,37.5 RECTIFIER:GRAETZ+DELON:TUNING_CAPS:C2.2_MID RECTIFIER:GRAETZ+DELON:TUNING_CAPS:C3.2_MID RECTIFIER:GRAETZ+DELON:TUNING_CAPS:C4.2_MID
  Bottom 0.5: RECTIFIER:GRAETZ+DELON:TUNING_CAPS:R2.1 v10.5,37.5
RECTIFIER:LDO_IN  (via drill 0.5)
  Top 0.5: v31.25,8.5 RECTIFIER:3V3:C2.1 31.1,8 RECTIFIER:3V3:IC2.IN | RECTIFIER:3V3:IC1.1_VDD 25.75,6.95 v25.75,7.25
  Route2 0.5: v25.75,7.25 27.25,7.25 | 27.25,7.25 31.25,7.25 v31.25,8.5 | RECTIFIER:3V3:R1.1 27.25,4.25 27.25,7.25
  Bottom 0.5: D501.C 25.7,10.5 R504.2 29.2,10.55 v31.25,8.5
  other vias: 26.75,3.75
RECTIFIER:OVP:ZENER_COMMON  (via drill 0.35)
  other vias: 3,30.5 5,30.5 3,28.5 5,28.5 3,26.5 5,26.5 3,24.5 5,24.5 3,22.5 5,22.5 3,20.5 5,20.5 3,18.5 5,18.5 3,16.5 5,16.5 3,32.5 5,32.5
  pour Top (isolate 0.254, no thermals): 1,15.5 9,15.5 9,33.5 1,33.5
  pour Bottom (isolate 0.254, no thermals): 9,16 1,16 1,33 9,33
RECTIFIER:SMOOTHINGCAP_IN
  Bottom 0.5: R502.2 13.5,22.5 RECTIFIER:SMOOTHING_CAP:D8.C
RECTIFIER:SMOOTHINGCAP_OUT  (via drill 0.35)
  Route2 0.5: RECTIFIER:SMOOTHING_CAP:C5.POS 23.5,15.52 v23.5,14.5
  Bottom 0.5: v16.75,22.5 RECTIFIER:SMOOTHING_CAP:D8.A 17.02,22.5 18.52,21 RECTIFIER:SMOOTHING_CAP:C5.POS | R505.1 23.25,14.75 v23.5,14.5
RECTIFIER:V_RECT_TP1-IN  (via drill 0.35)
  Bottom 0.5: v7.25,12 7.5,11.75 13.46,11.75 RECTIFIER:GRAETZ+DELON:DELON:C1.1_POS 13.46,18.8 R502.1
  other vias: 8,11 8.75,11 8.75,12 8,12 7.25,11 7.25,37 8,37 8.75,37 8.75,38 8,38 7.25,38
  pour Route2 (isolate 0.813): 6.5,38.5 6.5,10.5 9.25,10.5 9.25,38.5
  pour Top (no thermals): 6.75,38.25 9,38.25 9,36.75 6.75,36.75
  pour Bottom (no thermals): 9.25,38.25 7,38.25 7,36.75 9.25,36.75
  pour Top (no thermals): 6.75,12.25 9,12.25 9,10.75 6.75,10.75
  pour Bottom (no thermals): 9,12.25 7,12.25 7,10.75 9,10.75
RECTIFIER:VDC_TOWARDS_LDO
  Bottom 0.5: D502.C 25.45,12.75 R504.1
RECTIFIER:ZERO-CROSS_DETECTOR:OPAMP_IN+  (via drill 0.35)
  Top 0.25: RECTIFIER:ZERO-CROSS_DETECTOR:IC1.3_A_IN+ 18.25,5.5 v18,5.25
  Bottom 0.25: RECTIFIER:ZERO-CROSS_DETECTOR:R7.2 18,4.5 v18,5.25 18,5.75 RECTIFIER:ZERO-CROSS_DETECTOR:R2.2
RECTIFIER:ZERO-CROSS_DETECTOR:OPAMP_IN-  (via drill 0.35)
  Top 0.25: RECTIFIER:ZERO-CROSS_DETECTOR:IC1.2_A_IN- 17,6 v16,7
  Bottom 0.5: RECTIFIER:ZERO-CROSS_DETECTOR:C8.2 12.7,8.4 | 12.7,8.4 RECTIFIER:ZERO-CROSS_DETECTOR:R1.2 | 12.7,8.4 12.8,8.3 RECTIFIER:ZERO-CROSS_DETECTOR:D10.C v16,7
SENSE1+
  Top 0.3: IC601.11_SENSE1+ 62.75,28.25 63.83,29.33 R601.1 66.08,29.25
  Top 0.5: TP26.P$1 66.08,29.25
SENSE1-
  Top 0.3: 65.67,32.17 62.25,28.75 IC601.12_SENSE1-
  Top 0.5: TP27.P$1 68,31.75 67.58,32.17 R601.2 65.67,32.17
SENSE2+
  Top 0.3: IC601.10_SENSE2+ 62.75,27.75 63.83,26.67 R602.1
  Top 0.5: R602.1 66.08,26.75 TP28.P$1
SENSE2-
  Top 0.3: IC601.9_SENSE2- 62.25,27.25 65.67,23.83 R602.2
  Top 0.5: R602.2 66.25,23.83 67.58,23.83 68,24.25 TP29.P$1
SYS_NRST  (via drill 0.35)
  Top 0.25: IC302.4_NRST 53.5,17.5 54,17 C307.2 54.75,16.9 v54.75,16.5 | J1.12 52,8.07 v52,8.25
  Route2 0.25: v52,8.25 52.5,8.75 52.5,14.25 v54.75,16.5
SYS_SWCLK  (via drill 0.35)
  Top 0.25: IC302.22_PA14 48,14.75 v47.75,14.5 | v48.25,8.25 48.25,8.05 J1.6
  Route15 0.25: v48.25,8.25 49.24,9.24 49.24,13.01 v47.75,14.5
SYS_SWDIO  (via drill 0.35)
  Top 0.25: IC302.21_PA13 47,16 46.75,15.75 v46.75,15.25 | v47,8.25 47,8.07 J1.4
  Route15 0.25: v46.75,15.25 46.75,8.5 v47,8.25
VBUS1+
  Top 0.25: TP24.P$1 61.75,31.25 60.75,30.25 IC601.13_VBUS1+
VBUS2+
  Top 0.3: TP25.P$1 61.75,24.75 60.75,25.75 IC601.8_VBUS2+
VDC
  Bottom 0.5: 21.25,13.2 21.25,12.95 21.05,12.75 R3.2 D502.A 21.25,13.2 | 21.25,13.2 21.25,14.7 R505.2 R2.1
ZEROCROSS  (via drill 0.35)
  Top 0.25: v18,7 18,6.85 18.35,6.5 RECTIFIER:ZERO-CROSS_DETECTOR:IC1.1_A_OUT | IC302.14_PB0 48,19.75 v47,19.75
  Route2 0.25: v20,3.5 20,4.25 18,6.25 v18,7 18,8.16 21.34,11.5 24.94,11.5 33.69,20.25 46.5,20.25 v47,19.75
  Bottom 0.25: RECTIFIER:ZERO-CROSS_DETECTOR:R7.1 20,4.25 v20,3.5

## Text on the board
Top: GND | RECTIFIER:OVP:ZENER_COMMON | GND | GND
Route2: 3V3 | RECTIFIER:V_RECT_TP1-IN | 3V3 | 3V3
Route15: GND | GND | GND | GND
Bottom: GND | GND | GND | GND
tPlace: SCL | SDA | VBUS1+ | CA | S1- | S1+ | CB | S2+ | S2- | CC | VBUS2+ | PA6 | PA5 | PA4 | PA3 | PA2 | PA1 | CS | CD | H | Load | PB3 | PB4 | PB5 | PB6 | PB7 | PB8 | BAT+ | GND | L
bPlace: NC | NO | NC | NO | NO | NO | NO | NO | NO | NO | SCL | SW1 | CA | SW2 | CA | CB | CC | CB | CC | CD | X | SDA | S1- | VBUS1+ | S1+ | S2+ | VBUS2+ | S2- | PA6 | PA5 | PA4 | PA3 | PA2 | PA1 | Load | PB3 | PB4 | PB5 | PB6 | PB7 | PB8 | BAT+ | GND